# Altium schematic sheet SPI Encoders.SchDoc: Arm - SPI Encoders
size Letter; DrawnBy: N.Chapman, K.Hong; Organization: UW Robotics; Address1: 200 University Avenue; Address2: Waterloo; Address3: Ontario; Address4: Canada N2L 3G6; SheetNumber: 9; SheetTotal: 9
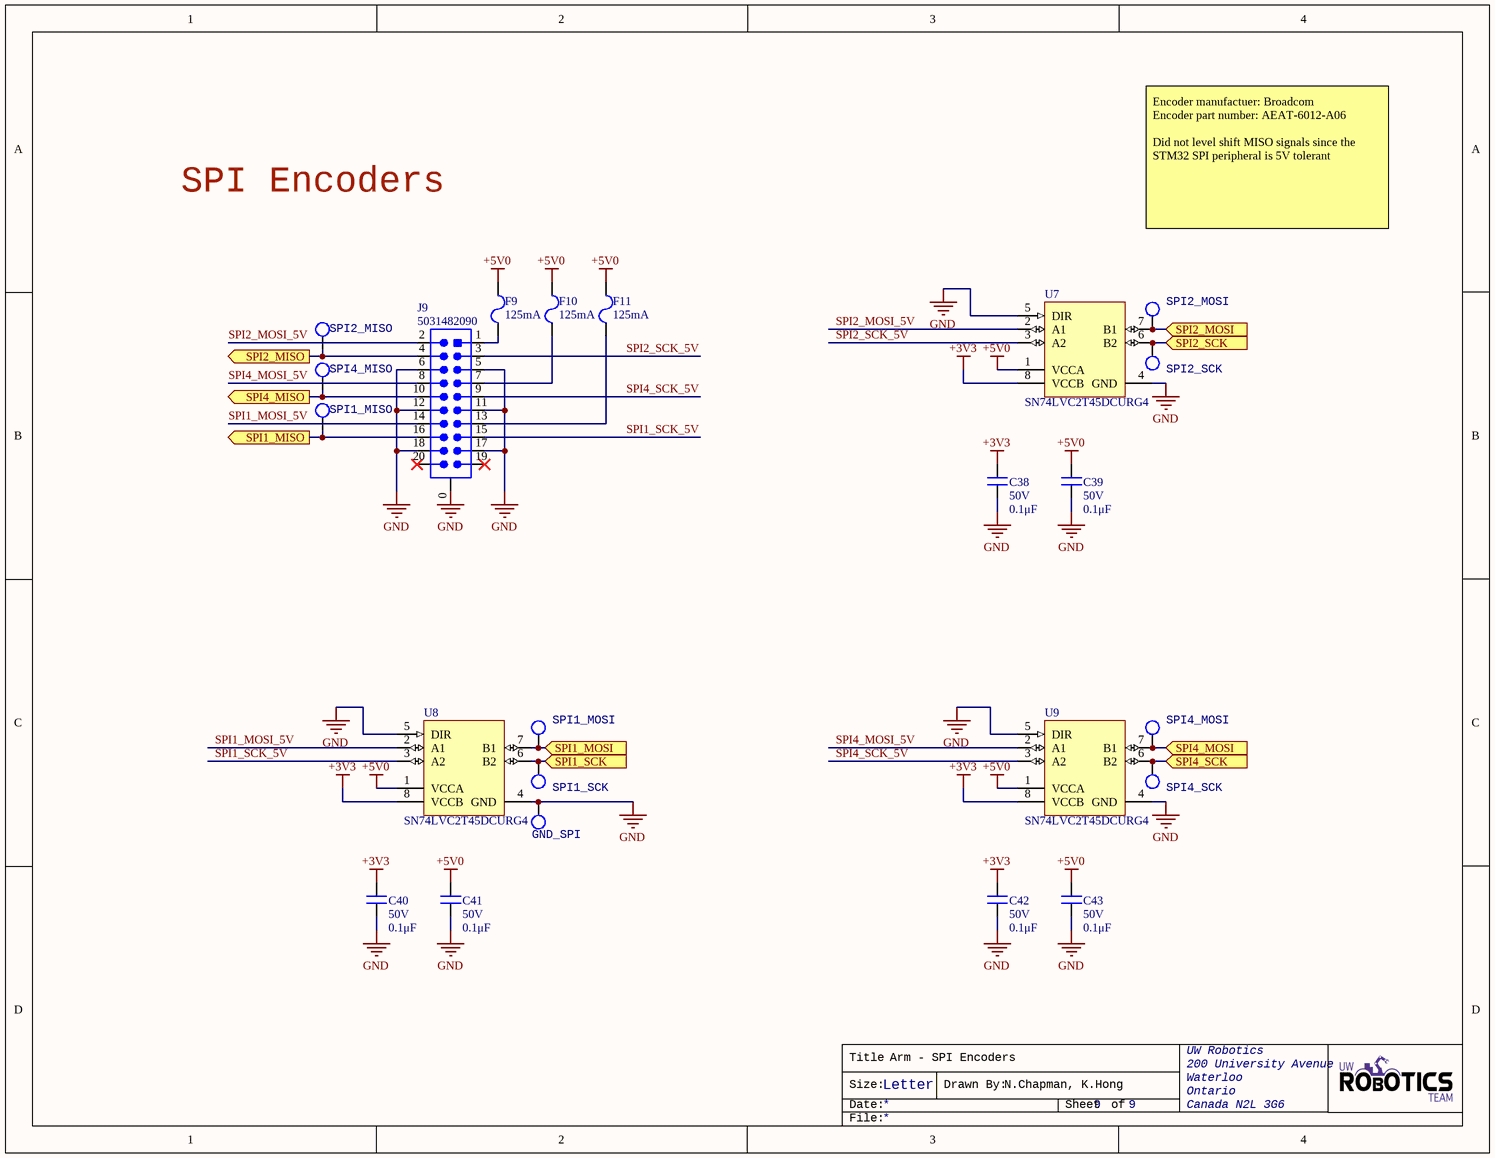
[diagram p0: SPI Encoders.SchDoc]

## Parts
C38  value 0.1μF  Voltage Rating: 50V  [CAPC0603(1608)55_N]  (hidden comment: CAP_0.1uF_50V_0603)
C39  value 0.1μF  Voltage Rating: 50V  [CAPC0603(1608)55_N]  (hidden comment: CAP_0.1uF_50V_0603)
C40  value 0.1μF  Voltage Rating: 50V  [CAPC0603(1608)55_N]  (hidden comment: CAP_0.1uF_50V_0603)
C41  value 0.1μF  Voltage Rating: 50V  [CAPC0603(1608)55_N]  (hidden comment: CAP_0.1uF_50V_0603)
C42  value 0.1μF  Voltage Rating: 50V  [CAPC0603(1608)55_N]  (hidden comment: CAP_0.1uF_50V_0603)
C43  value 0.1μF  Voltage Rating: 50V  [CAPC0603(1608)55_N]  (hidden comment: CAP_0.1uF_50V_0603)
F9  Current Rating: 125mA  [FUSE_1206]  (hidden comment: FUSE_125mA_1206)
F10  Current Rating: 125mA  [FUSE_1206]  (hidden comment: FUSE_125mA_1206)
F11  Current Rating: 125mA  [FUSE_1206]  (hidden comment: FUSE_125mA_1206)
GND_SPI  TESTPOINT_LOOP  [TESTPOINT_LOOP]  (value not drawn)
J9  Manufacturer Part Number 1: 5031482090  [MOLEX-5031482090]  (hidden comment: CON_10x2M_SM_RA)
SPI1_MISO  TESTPOINT_LOOP  [TESTPOINT_LOOP]  (value not drawn)
SPI1_MOSI  TESTPOINT_LOOP  [TESTPOINT_LOOP]  (value not drawn)
SPI1_SCK  TESTPOINT_LOOP  [TESTPOINT_LOOP]  (value not drawn)
SPI2_MISO  TESTPOINT_LOOP  [TESTPOINT_LOOP]  (value not drawn)
SPI2_MOSI  TESTPOINT_LOOP  [TESTPOINT_LOOP]  (value not drawn)
SPI2_SCK  TESTPOINT_LOOP  [TESTPOINT_LOOP]  (value not drawn)
SPI4_MISO  TESTPOINT_LOOP  [TESTPOINT_LOOP]  (value not drawn)
SPI4_MOSI  TESTPOINT_LOOP  [TESTPOINT_LOOP]  (value not drawn)
SPI4_SCK  TESTPOINT_LOOP  [TESTPOINT_LOOP]  (value not drawn)
U7  SN74LVC2T45DCURG4  [DCU0008A_L]
U8  SN74LVC2T45DCURG4  [DCU0008A_L]
U9  SN74LVC2T45DCURG4  [DCU0008A_L]

## Ports
SPI1_MISO (out), SPI1_MOSI (in), SPI1_SCK (in), SPI2_MISO (out), SPI2_MOSI (in), SPI2_SCK (in), SPI4_MISO (out), SPI4_MOSI (in), SPI4_SCK (in)

## Nets
+3V3: C38.2 C40.2 C42.2 U7.8(VCCB) U8.8(VCCB) U9.8(VCCB)
+5V0: C39.2 C41.2 C43.2 F9.1 F10.1 F11.1 U7.1(VCCA) U8.1(VCCA) U9.1(VCCA)
GND: C38.1 C39.1 C40.1 C41.1 C42.1 C43.1 GND_SPI.1 J9.0 J9.5 J9.6 J9.11 J9.12 J9.17 J9.18 U7.4(GND) U7.5(DIR) U8.4(GND) U8.5(DIR) U9.4(GND) U9.5(DIR)
SPI1_MISO: J9.16 SPI1_MISO.1 ; port SPI1_MISO
SPI1_MOSI: SPI1_MOSI.1 U8.7(B1) ; port SPI1_MOSI
SPI1_MOSI_5V: J9.14 U8.2(A1)
SPI1_SCK: SPI1_SCK.1 U8.6(B2) ; port SPI1_SCK
SPI1_SCK_5V: J9.15 U8.3(A2)
SPI2_MISO: J9.4 SPI2_MISO.1 ; port SPI2_MISO
SPI2_MOSI: SPI2_MOSI.1 U7.7(B1) ; port SPI2_MOSI
SPI2_MOSI_5V: J9.2 U7.2(A1)
SPI2_SCK: SPI2_SCK.1 U7.6(B2) ; port SPI2_SCK
SPI2_SCK_5V: J9.3 U7.3(A2)
SPI4_MISO: J9.10 SPI4_MISO.1 ; port SPI4_MISO
SPI4_MOSI: SPI4_MOSI.1 U9.7(B1) ; port SPI4_MOSI
SPI4_MOSI_5V: J9.8 U9.2(A1)
SPI4_SCK: SPI4_SCK.1 U9.6(B2) ; port SPI4_SCK
SPI4_SCK_5V: J9.9 U9.3(A2)
NetF9_2: F9.2 J9.1
NetF10_2: F10.2 J9.7
NetF11_2: F11.2 J9.13

Not connected (* = marked no-connect by the designer): J9 19* 20*

## Notes on the sheet
- SPI Encoders
- Encoder manufactuer: Broadcom
  Encoder part number: AEAT-6012-A06
  Did not level shift MISO signals since the STM32 SPI peripheral is 5V tolerant
- Title
- Size:
- Date:
- Letter
- Drawn By:
- Sheet
- of
- File:

## Library data of the parts
C38-C43 = CAP_0.1uF_50V_0603: CAP CER 0.1UF 50V X7R 0603; Manufacturer Part Number 1: CC0603KRX7R9BB104; Manufacturer 1: Yageo; Dimensions: 0.063" L x 0.031" W (1.60mm x 0.80mm); Package: 0603 (1608 Metric); Temperature Coefficient: X7R; Supplier Part Number 1: 311-1344-1-ND; Supplier 1: Digi-Key; Mount: Surface Mount; Case Code (Imperial): 0603; Case Code (Metric): 1608; Dielectric: X7R
F9-F11 = FUSE_125mA_1206: FUSE SMD 125mA 125V; Manufacturer 1: Littelfuse; Manufacturer Part Number 1: 0466.125NRHF; DC Cold Resistance: 4R; Fuse Type: Board Mount (Cartridge Style Excluded); Power Dissipation: 69.1mW; Approvals: UL,CSA; Supplier 1: Digi-Key; Stock 1: 10036; Pricing 1: 1=0.84000, 5=0.81200, 10=0.78700, 50=0.66180, 100=0.54930, 250=0.49940, 500=0.42450, 1000=0.37455 (USD); RoHS: Yes; Mount: Surface Mount; Case/Package: 1206; Case Code (Metric): 3216; Case Code (Imperial): 1206; Housing Material: Ceramic; Min Operating Temperature: -55°C; Max Operating Temperature: 90°C; Packaging: Tape and Reel; Voltage Rating (AC): 125V; Voltage Rating (DC): 125V; Working Voltage: 125V; Package Quantity: 5000; Length: 3.18mm; Height: 0.023inch; Depth: 1.52mm; Width: 0.06inch; Lead Free: Lead Free; ComponentLink1URL: https://datasheet.ciiva.com/303/littelfuse-fuse-466-303205.pdf?src-supplier=Digi-Key; ComponentLink1Description: https://datasheet.ciiva.com/303/littelfuse-fuse-466-303205.pdf?src-supplier=Digi-Key; Supplier Part Number 1: F6016CT-ND
GND_SPI SPI1_MISO SPI1_MOSI SPI1_SCK SPI2_MISO SPI2_MOSI SPI2_SCK SPI4_MISO SPI4_MOSI SPI4_SCK = TESTPOINT_LOOP: Loop testpoint through-hole pad; Manufacturer Part Number 1: 5002; Manufacturer 1: Keystone Electronics; Supplier Part Number 1: 36-5002-ND; Supplier 1: Digi-Key; Mount: Through Hole
J9 = CON_10x2M_SM_RA: CONN HEADER SMD RIGHT ANGLE 1.5MM PITCH; Manufacturer 1: Molex; Voltage Rating: 100V; Current Rating: 1A; Connector Type: Receptacle,Forked,Center Strip Contact; Number of Positions: 20; Gender: Receptacle; Glow Wire Compliant: Non-compliant; Supplier 1: Digi-Key; Stock 1: 1742; Pricing 1: 1=2.37000, 10=2.14700, 100=1.83990 (USD); RoHS: Yes; Mount: Surface Mount,Through Hole; Housing Material: Resin; Color: Beige; Housing Color: Beige; Contact Material: Copper Alloy,Copper,Tin; Contact Plating: Tin; Min Operating Temperature: -25°C; Max Operating Temperature: 85°C; Number of Rows: 2; Packaging: Tape and Reel; Package Quantity: 550; Fastening Type: Latch; Orientation: Right Angle; Termination: Solder; Number of Contacts: 20; Contact Gender: Female; Number of Circuits: 20; Length: 19.3mm; Pitch: 1.5mm; Row Spacing: 1.5mm; Depth: 9.55mm; Radiation Hardening: No; REACH SVHC: No SVHC; ComponentLink1URL: https://datasheet.ciiva.com/6787/5031482090-sd-6787557.pdf?src-supplier=Digi-Key; ComponentLink1Description: https://datasheet.ciiva.com/6787/5031482090-sd-6787557.pdf?src-supplier=Digi-Key; ComponentLink2URL: https://datasheet.ciiva.com/10076/5031482090-pcb-receptacles-10076785.pdf?src-supplier=Avnet; ComponentLink2Description: https://datasheet.ciiva.com/10076/5031482090-pcb-receptacles-10076785.pdf?src-supplier=Avnet; ComponentLink3URL: https://datasheet.ciiva.com/5153/5031482090-pcb-receptacles-179510-5153198.pdf?src-supplier=Mouser; ComponentLink3Description: https://datasheet.ciiva.com/5153/5031482090-pcb-receptacles-179510-5153198.pdf?src-supplier=Mouser; ComponentLink4URL: https://datasheet.ciiva.com/30082/72715031482090-pcb-receptacles-30082526.pdf?src-supplier=Onlinecomponents.com; ComponentLink4Description: https://datasheet.ciiva.com/30082/72715031482090-pcb-receptacles-30082526.pdf?src-supplier=Onlinecomponents.com; ComponentLink5URL: https://datasheet.ciiva.com/6787/5031482090-sd-6787542.pdf?src-supplier=Digi-Key; ComponentLink5Description: https://datasheet.ciiva.com/6787/5031482090-sd-6787542.pdf?src-supplier=Digi-Key; ComponentLink6URL: https://datasheet.ciiva.com/6787/5031482090-sd-6787548.pdf?src-supplier=Digi-Key; ComponentLink6Description: https://datasheet.ciiva.com/6787/5031482090-sd-6787548.pdf?src-supplier=Digi-Key; Supplier Part Number 1: WM9451CT-ND
U7-U9 = CMP-0859-00013-4: Dual-Bit Dual Supply Transceiver with Configurable Voltage Translation and 3-State Outputs, DCU0008A, LARGE T&R; Manufacturer: Texas Instruments; tpd @ Nom Voltage(Max)(ns): 17.7,10.3,8.3,7.2; Logic: True; Rating: Military; ICC @ Nom Voltage(Max)(mA): 0.004; Bits(#): 2; 3-State Output: Yes; Schmitt Trigger: No; Technology Family: LVC; Sub-Family: Dual Supply Translator; Output Drive (IOL/IOH)(Max)(mA): 32/-32; Output Type: CMOS; VCC(Max)(V): 5.5; Input Type: CMOS/TTL; F @ Nom Voltage(Max)(Mhz): 150; VCC(Min)(V): 1.65; Voltage(Nom)(V): 1.8,2.5,3.3,5; PackageReference: DCU0008A; Generic Part Number: SN74LVC2T45; DatasheetVersion: SCES516J; Operating Temperature Range(C): -40 to 85